# Altium schematic sheet digital-in.SchDoc
size A4
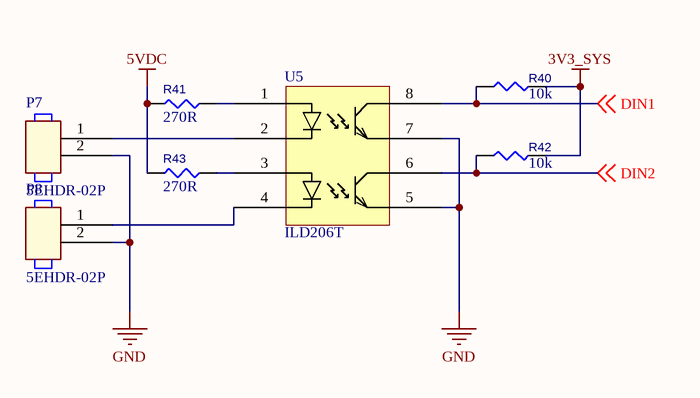
[diagram p0: digital-in.SchDoc]

## Parts
P7  P/N: 5EHDR-02P  [TE_282814-2]  (hidden comment: TE_282814-2)
P8  P/N: 5EHDR-02P  [TE_282814-2]  (hidden comment: TE_282814-2)
R40  value 10k  [RESC1608X55N]  (hidden comment: R0603)
R41  value 270R  [RESC1608X55N]  (hidden comment: R0603)
R42  value 10k  [RESC1608X55N]  (hidden comment: R0603)
R43  value 270R  [RESC1608X55N]  (hidden comment: R0603)
U5  ILD206T  [SOIC-8-OPTOCOUPLER]

## Nets
3V3_SYS: R40.2 R42.2
5VDC: R41.1 R43.1
GND: P7.2 P8.2 U5.5(TE1) U5.7(TE1)
DIN1: R40.1 U5.8(TC1) ; off-sheet DIN1
DIN2: R42.1 U5.6(TC2) ; off-sheet DIN2
NetP7_1: P7.1 U5.2(C1)
NetP8_1: P8.1 U5.4(C2)
NetR41_2: R41.2 U5.1(A1)
NetR43_2: R43.2 U5.3(A2)

## Library data of the parts
P7 P8 = TE_282814-2: Terminal Block Connectors; Manufacturer: TE Connectivity
U5 = ILD206T: Optocoupler, Phototransistor Output, Dual Channel; Manufacturer: *; P/N: ILD206T
R40-R43 = R0603: P/N: *